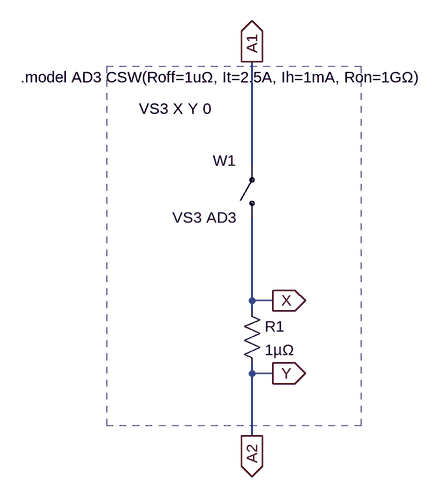
[diagram p0: schematic fuse1.asc]
fuse1.asc, the LTspice schematic file:
Version 4
SHEET 1 2036 932
WIRE -2176 -720 -2176 -880
WIRE -2176 -512 -2176 -640
WIRE -2144 -512 -2176 -512
WIRE -2176 -496 -2176 -512
WIRE -2176 -400 -2176 -416
WIRE -2144 -400 -2176 -400
WIRE -2176 -304 -2176 -400
FLAG -2144 -512 X
IOPIN -2144 -512 Out
FLAG -2144 -400 Y
IOPIN -2144 -400 Out
FLAG -2176 -880 A1
IOPIN -2176 -880 Out
FLAG -2176 -304 A2
IOPIN -2176 -304 Out
SYMBOL res -2192 -512 R0
SYMATTR InstName R1
SYMATTR Value 1µΩ
SYMBOL csw -2176 -640 R180
WINDOW 3 24 0 Left 2
WINDOW 0 24 88 Left 2
SYMATTR Value VS3 AD3
SYMATTR InstName W1
TEXT -1912 -856 Right 2 !.model AD3 CSW(Roff=1uΩ, It=2.5A, Ih=1mA, Ron=1GΩ)
TEXT -2240 -808 Right 2 !VS3 X Y 0
RECTANGLE Normal -2400 -320 -2008 -872 2

The netlist it stands for:
* fuse1.asc
R1 X A2 1µΩ
W1 X A1 VS3 AD3
.model AD3 CSW(Roff=1uΩ, It=2.5A, Ih=1mA, Ron=1GΩ)
VS3 X Y 0
.backanno
.end